# Altium project Sinusoidal Signal Generator.PrjPcb
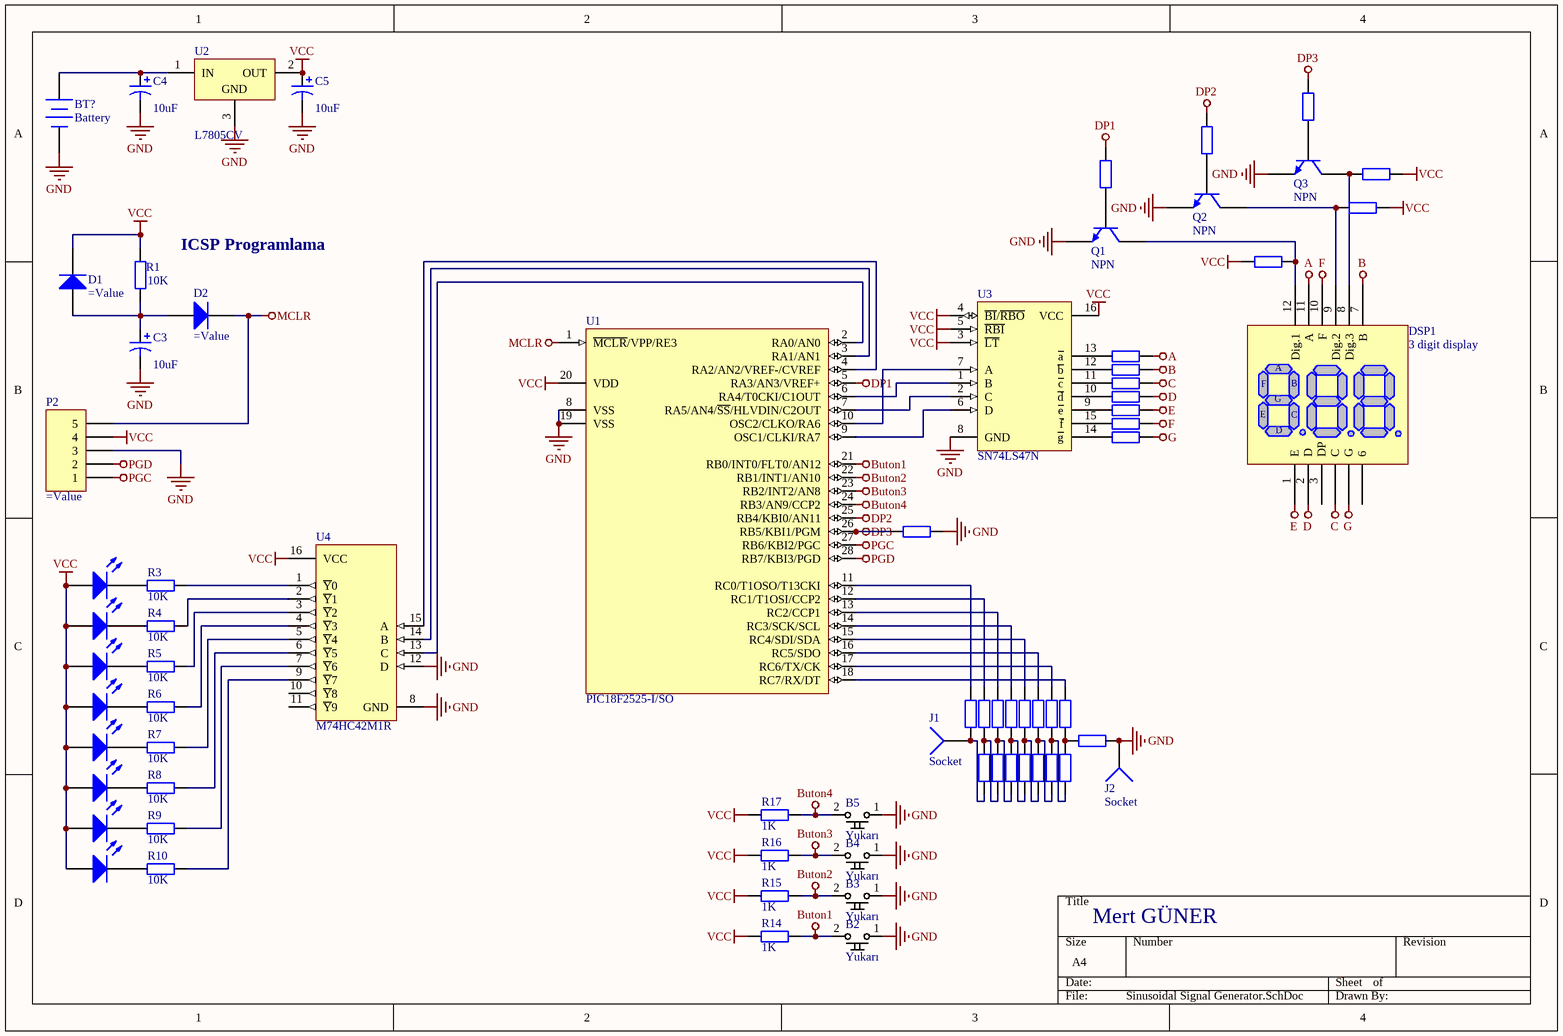
[diagram p0: Sinusoidal Signal Generator.SchDoc]
1 sheet, 72 parts. Net scope: global (net labels, ports and power ports of the same name join across sheets).
Board file: Sinusoidal Signal Generator.PcbDoc

## Sheet Sinusoidal Signal Generator.SchDoc
size A4

### Parts
B2  Yukarı  [Kucuk Buton Ucgen]
B3  Yukarı  [Kucuk Buton Ucgen]
B4  Yukarı  [Kucuk Buton Ucgen]
B5  Yukarı  [Kucuk Buton Ucgen]
BT?  Battery  [BAT-2]
C3  10uF  [1812LF -W]
C4  10uF  [1812LF -W]
C5  10uF  [1812LF -W]
D1  (no value)  [Mll32]
D2  (no value)  [Mll32]
D3  LED0  [Led 4mm Sari]  (value not drawn)
D4  LED0  [Led 4mm Sari]  (value not drawn)
D5  LED0  [Led 4mm Sari]  (value not drawn)
D6  LED0  [Led 4mm Sari]  (value not drawn)
D7  LED0  [Led 4mm Sari]  (value not drawn)
D8  LED0  [Led 4mm Sari]  (value not drawn)
D9  LED0  [Led 4mm Sari]  (value not drawn)
D10  LED0  [Led 4mm Sari]  (value not drawn)
DSP1  3 digit display  [3 digit]
J1  Socket  [PIN1]
J2  Socket  [PIN1]
P2  (no value)  [HDR1X5H]
Q1  NPN  [BCY-W3]
Q2  NPN  [BCY-W3]
Q3  NPN  [BCY-W3]
R1  10K  [0805 - res]
R2  10K  [0805 - res]  (value not drawn)
R3  10K  [0805 - res]
R4  10K  [0805 - res]
R5  10K  [0805 - res]
R6  10K  [0805 - res]
R7  10K  [0805 - res]
R8  10K  [0805 - res]
R9  10K  [0805 - res]
R10  10K  [0805 - res]
R14  1K  [0805 - res]
R15  1K  [0805 - res]
R16  1K  [0805 - res]
R17  1K  [0805 - res]
R18  2K  [0805 - res]  (value not drawn)
R19  2K  [0805 - res]  (value not drawn)
R20  2K  [0805 - res]  (value not drawn)
R21  2K  [0805 - res]  (value not drawn)
R22  2K  [0805 - res]  (value not drawn)
R23  2K  [0805 - res]  (value not drawn)
R24  2K  [0805 - res]  (value not drawn)
R25  2K  [0805 - res]  (value not drawn)
R26  1K  [0805 - res]  (value not drawn)
R27  1K  [0805 - res]  (value not drawn)
R28  1K  [0805 - res]  (value not drawn)
R29  1K  [0805 - res]  (value not drawn)
R30  2K  [0805 - res]  (value not drawn)
R31  2K  [0805 - res]  (value not drawn)
R32  2K  [0805 - res]  (value not drawn)
R33  2K  [0805 - res]  (value not drawn)
R40  2K2  [0805 - res]  (value not drawn)
R41  2K2  [0805 - res]  (value not drawn)
R42  2K2  [0805 - res]  (value not drawn)
R43  220  [0805 - res]  (value not drawn)
R44  220  [0805 - res]  (value not drawn)
R45  220  [0805 - res]  (value not drawn)
R46  220  [0805 - res]  (value not drawn)
R47  220  [0805 - res]  (value not drawn)
R48  220  [0805 - res]  (value not drawn)
R49  220  [0805 - res]  (value not drawn)
R50  220  [0805 - res]  (value not drawn)
R51  220  [0805 - res]  (value not drawn)
R52  220  [0805 - res]  (value not drawn)
U1  PIC18F2525-I/SO  [SOIC-SO28_N]
U2  L7805CV  [TO220ABN]
U3  SN74LS47N  [N016]
U4  M74HC42M1R  [SO16_N]

### Nets
A: DSP1.11(A) R43.1
B: DSP1.7(B) R44.1
Buton1: B2.2 R14.1 U1.21(RB0/INT0/FLT0/AN12)
Buton2: B3.2 R15.1 U1.22(RB1/INT1/AN10)
Buton3: B4.2 R16.1 U1.23(RB2/INT2/AN8)
Buton4: B5.2 R17.1 U1.24(RB3/AN9/CCP2)
C: DSP1.4(C) R45.1
D: DSP1.2(D) R46.1
DP1: R42.2 U1.5(RA3/AN3/VREF+)
DP2: R41.2 U1.25(RB4/KBI0/AN11)
DP3: R2.1 R40.2 U1.26(RB5/KBI1/PGM)
E: DSP1.1(E) R47.1
F: DSP1.10(F) R48.1
G: DSP1.5(G) R49.1
GND: B2.1 B3.1 B4.1 B5.1 BT?.2(-) C3.2 C4.2 C5.2 J2.1 P2.3 Q1.3(E) Q2.3(E) Q3.3(E) R2.2 R30.1 U1.8(VSS) U1.19(VSS) U2.3(GND) U3.8(GND) U4.8(GND) U4.12(D)
MCLR: D2.2(K) P2.5 U1.1(~{MCLR}/VPP/RE3)
PGC: P2.1 U1.27(RB6/KBI2/PGC)
PGD: P2.2 U1.28(RB7/KBI3/PGD)
VCC: C5.1 D1.2(K) D3.1(A) D4.1(A) D5.1(A) D6.1(A) D7.1(A) D8.1(A) D9.1(A) D10.1(A) P2.4 R1.2 R14.2 R15.2 R16.2 R17.2 R50.1 R51.1 R52.2 U1.20(VDD) U2.2(OUT) U3.3(~{LT}) U3.4(~{BI}/~{RBO}) U3.5(~{RBI}) U3.16(VCC) U4.16(VCC)
NetBT?_1: BT?.1(+) C4.1 U2.1(IN)
NetC3_1: C3.1 D1.1(A) D2.1(A) R1.1
NetD3_2: D3.2(K) R3.1
NetD4_2: D4.2(K) R4.1
NetD5_2: D5.2(K) R5.1
NetD6_2: D6.2(K) R6.1
NetD7_2: D7.2(K) R7.1
NetD8_2: D8.2(K) R8.1
NetD9_2: D9.2(K) R9.1
NetD10_2: D10.2(K) R10.1
NetDSP1_8: DSP1.8(Dig.3) Q3.1(C) R50.2
NetDSP1_9: DSP1.9(Dig.2) Q2.1(C) R51.2
NetDSP1_12: DSP1.12(Dig.1) Q1.1(C) R52.1
NetJ1_1: J1.1 R25.1 R29.1
NetQ1_2: Q1.2(B) R42.1
NetQ2_2: Q2.2(B) R41.1
NetQ3_2: Q3.2(B) R40.1
NetR3_2: R3.2 U4.1(~{Y}0)
NetR4_2: R4.2 U4.2(~{Y}1)
NetR5_2: R5.2 U4.3(~{Y}2)
NetR6_2: R6.2 U4.4(~{Y}3)
NetR7_2: R7.2 U4.5(~{Y}4)
NetR8_2: R8.2 U4.6(~{Y}5)
NetR9_2: R9.2 U4.7(~{Y}6)
NetR10_2: R10.2 U4.9(~{Y}7)
NetR18_1: R18.1 R26.2 R30.2
NetR18_2: R18.2 U1.18(RC7/RX/DT)
NetR19_1: R19.1 R26.1 R31.1
NetR19_2: R19.2 U1.17(RC6/TX/CK)
NetR20_1: R20.1 R27.2 R31.2
NetR20_2: R20.2 U1.16(RC5/SDO)
NetR21_1: R21.1 R27.1 R32.1
NetR21_2: R21.2 U1.15(RC4/SDI/SDA)
NetR22_1: R22.1 R28.2 R32.2
NetR22_2: R22.2 U1.14(RC3/SCK/SCL)
NetR23_1: R23.1 R28.1 R33.1
NetR23_2: R23.2 U1.13(RC2/CCP1)
NetR24_1: R24.1 R29.2 R33.2
NetR24_2: R24.2 U1.12(RC1/T1OSI/CCP2)
NetR25_2: R25.2 U1.11(RC0/T1OSO/T13CKI)
NetR43_2: R43.2 U3.13(~{a})
NetR44_2: R44.2 U3.12(~{b})
NetR45_2: R45.2 U3.11(~{c})
NetR46_2: R46.2 U3.10(~{d})
NetR47_2: R47.2 U3.9(~{e})
NetR48_2: R48.2 U3.15(~{f})
NetR49_2: R49.2 U3.14(~{g})
NetU1_2: U1.2(RA0/AN0) U4.13(C)
NetU1_3: U1.3(RA1/AN1) U4.14(B)
NetU1_4: U1.4(RA2/AN2/VREF-/CVREF) U4.15(A)
NetU1_6: U1.6(RA4/T0CKI/C1OUT) U3.1(B)
NetU1_7: U1.7(RA5/AN4/~{SS}/HLVDIN/C2OUT) U3.2(C)
NetU1_9: U1.9(OSC1/CLKI/RA7) U3.6(D)
NetU1_10: U1.10(OSC2/CLKO/RA6) U3.7(A)

Not connected (* = marked no-connect by the designer): DSP1 3(DP) 6; U4 10(~{Y}8) 11(~{Y}9)

### Notes on the sheet
- ICSP Programlama
- Mert GÜNER

### Library data of the parts
B2-B5 = Button: Value: Yukarı
BT? = Battery: Multicell Battery; Published: 24-Mar-1999; LatestRevisionDate: 17-Jul-2002; LatestRevisionNote: Re-released for DXP Platform.; PackageReference: BAT-2; Publisher: Altium Limited
C3-C5 = Cap Pol1: Polarized Capacitor (Radial); Published: 8-Jun-2000; LatestRevisionDate: 17-Jul-2002; LatestRevisionNote: Re-released for DXP Platform.; PackageReference: RB7.6-15; Publisher: Altium Limited; Value: 10uF
D1 D2 = Diode 1N914: High Conductance Fast Diode; Published: 8-Jun-2000; LatestRevisionDate: 17-Jul-2002; LatestRevisionNote: Re-released for DXP Platform.; DatasheetVersion: 1997; PackageReference: DO-35; Publisher: Altium Limited; Code_JEDEC: DO-204-AH; ComponentLink1Description: Manufacturer Link; ComponentLink1URL: http://www.fairchildsemi.com/; ComponentLink2Description: Datasheet; ComponentLink2URL: http://www.fairchildsemi.com/ds/1N%2F1N4448.pdf
D3-D10 = LED0: Typical INFRARED GaAs LED; Published: 8-Jun-2000; LatestRevisionDate: 08-Jul-2005; LatestRevisionNote: Mech Layer 1 removed.; PackageReference: LED-0; Publisher: Altium Limited
DSP1 = 3digit display
P2 = Header 5: Header, 5-Pin; LatestRevisionDate: 17-Jul-2002; LatestRevisionNote: Re-released for DXP Platform.; Publisher: Altium Limited
Q1-Q3 = NPN: NPN Bipolar Transistor; Published: 8-Jun-2000; LatestRevisionDate: 17-Jul-2002; LatestRevisionNote: Re-released for DXP Platform.; PackageReference: TO-226; Publisher: Altium Limited; Code_JEDEC: TO-226-AA
R1-R10 R14-R33 R40-R52 = Res2: Resistor; Published: 8-Jun-2000; LatestRevisionDate: 17-Jul-2002; LatestRevisionNote: Re-released for DXP Platform.; PackageReference: AXIAL-0.4; Publisher: Altium Limited
  R1-R10: Value: 10K
  R14-R17 R26-R29: Value: 1K
  R18-R25 R30-R33: Value: 2K
  R40-R42: Value: 2K2
  R43-R52: Value: 220
U1 = PIC18F2525-I/SO: Enhanced Flash Microcontroller with 10-Bit A/D and nanoWatt Technology, 48K Flash, 28-Pin SOIC, Industrial Temperature Range; FirstPublished: 29-Jan-2009; DatasheetVersion: revE, May-2008; PackageVersion: revBB, Aug-2009; PackageReference: SOIC-SO28; Publisher: Altium Limited; PackageDescription: 28-Lead Plastic Small Outline (SO) - Wide 7.50mm Body [SOIC]; Supplier 1: Digi-Key; Supplier Part Number 1: PIC18F2525-I/SO-ND; Supplier 2: Farnell; Supplier Part Number 2: 1212694; Supplier 3: Newark; Supplier Part Number 3: 89H0598; Code_JEDEC: MS-013; ComponentLink1Description: Datasheet; ComponentLink1URL: http://ww1.microchip.com/downloads/en/DeviceDoc/39626e.pdf; ComponentLink2Description: Packaging Specification; ComponentLink2URL: http://www.microchip.com/stellent/groups/techpub_sg/documents/packagingspec/en012702.pdf; ComponentLink3Description: Microchip.com Home; ComponentLink3URL: http://www.microchip.com/
U2 = L7805CV: Positive Voltage Regulator; Note: Tab is connected to pin 3 (GND).; Published: 24-Aug-2001; LatestRevisionDate: 17-Jul-2002; LatestRevisionNote: Re-released for DXP Platform.; DatasheetVersion: Dec-1998; PackageVersion: Jun-1998; PackageReference: TO220ABN; Publisher: Altium Limited; PackageDescription: TO, Thru-Hole, Vertical, Heatsink Mounted; 3 In-Line Leads; Pitch 2.54 mm; Pin sequence 1, 3, 2; ComponentLink1Description: Manufacturer Link; ComponentLink1URL: http://www.st.com/
U3 = SN74LS47N: BCD-to-Seven-Segment Decoder/Driver; Published: 8-Jun-2000; LatestRevisionDate: 29-May-2009; LatestRevisionNote: Component Body Added.; DatasheetVersion: Mar-1988; PackageVersion: Oct-1995; PackageReference: N016; Publisher: Altium Limited; PackageDescription: DIP, 16-Pin, Row Spacing 7.62 mm, Pitch 2.54 mm; Code_JEDEC: MS-001-BB; ComponentLink1Description: Manufacturer Link; ComponentLink1URL: http://www.ti.com/; ComponentLink2Description: Datasheet; ComponentLink2URL: http://www-s.ti.com/sc/ds/sn74ls47.pdf; ComponentLink3Description: URL Link1; ComponentLink3URL: http://focus.ti.com/docs/prod/folders/print/sn74ls47.html
U4 = M74HC42M1R: BCD-to-Decimal Decoder; Published: 8-Jun-2000; LatestRevisionDate: 13-Apr-2006; LatestRevisionNote: IPC-7351 Footprint Added.; DatasheetVersion: Dec-1992; PackageVersion: May-1998; PackageReference: SO16; Publisher: Altium Limited; PackageDescription: 16-Pin Small Outline Integrated Circuit 1.27 mm Pitch; Code_IPC: SOIC127P600-16; ComponentLink1Description: Manufacturer Link; ComponentLink1URL: http://www.st.com/; ComponentLink2Description: Datasheet; ComponentLink2URL: http://www.st.com/stonline/products/literature/ds/1973/m74hc42.pdf
J1 J2 = Socket: LatestRevisionDate: 17-Jul-2002; LatestRevisionNote: Re-released for DXP Platform.; Publisher: Altium Limited